# Altium project LPL_Control_board_Rev3.PrjPcb
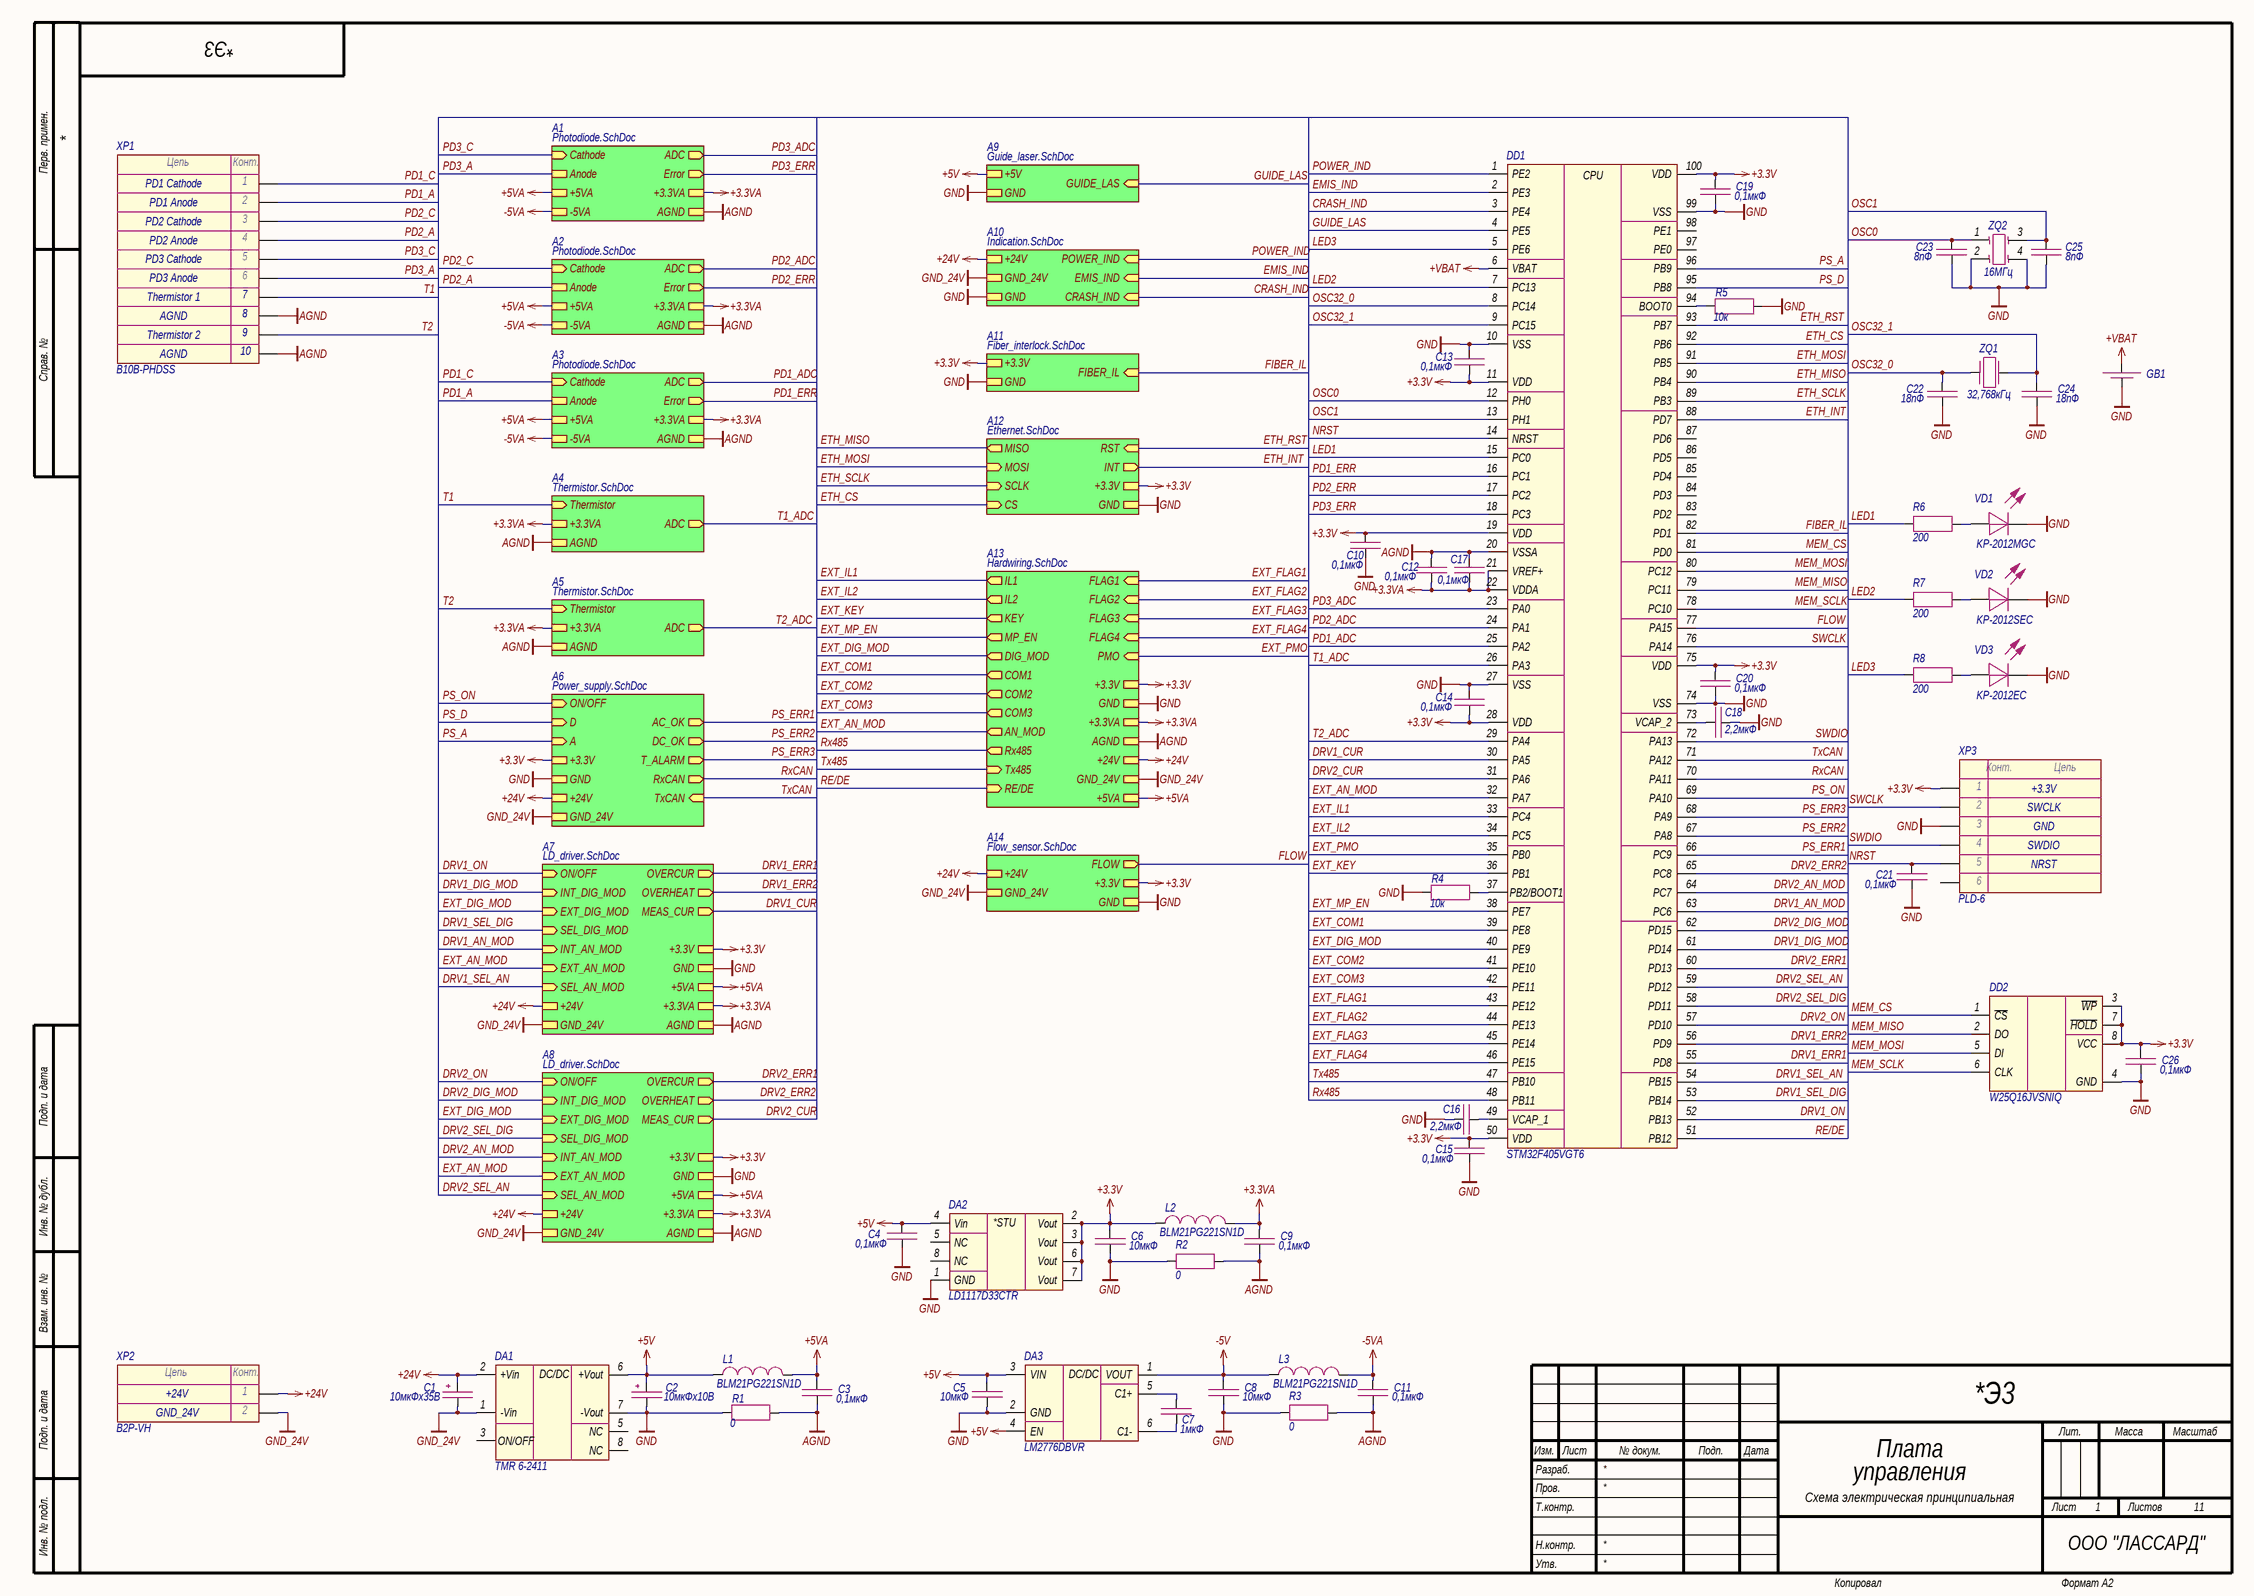
[diagram p0: Main.SchDoc]
6 sheets, 246 parts. Net scope: strictly hierarchical (ports join the sheet entries above them; power ports are local).
Board file: PCB1.PcbDoc
Sheets:
  Main.SchDoc
    A10 = Indication.SchDoc
    A13 = Hardwiring.SchDoc
    A1 = Photodiode.SchDoc
    A6 = Power_supply.SchDoc
    A9 = Guide_laser.SchDoc
    A2 = Photodiode.SchDoc
    A3 = Photodiode.SchDoc

## Sheet Main.SchDoc: Плата
size 594 x 420 mm; CompanyName: ООО "ЛАССАРД"; Address1: Address1; Address2: Address2; Address3: Address3; Address4: Address4; DocumentNumber: *Э3; SheetNumber: 1; SheetTotal: 11; Title2str: управления; DocumentType: Схема электрическая принципиальная

### Parts
C1  10мкФх35B  [CAP_C]
C2  10мкФх10B  [CAP_A]
C3  0,1мкФ  [CAP_0603]
C4  0,1мкФ  [CAP_0603]
C5  10мкФ  [CAP_0603]
C6  10мкФ  [CAP_0603]
C7  1мкФ  [CAP_0603]
C8  10мкФ  [CAP_0603]
C9  0,1мкФ  [CAP_0603]
C10  0,1мкФ  [CAP_0603]
C11  0,1мкФ  [CAP_0603]
C12  0,1мкФ  [CAP_0603]
C13  0,1мкФ  [CAP_0603]
C14  0,1мкФ  [CAP_0603]
C15  0,1мкФ  [CAP_0603]
C16  2,2мкФ  [CAP_0603]
C17  0,1мкФ  [CAP_0603]
C18  2,2мкФ  [CAP_0603]
C19  0,1мкФ  [CAP_0603]
C20  0,1мкФ  [CAP_0603]
C21  0,1мкФ  [CAP_0603]
C22  18пФ  [CAP_0603]
C23  8пФ  [CAP_0603]
C24  18пФ  [CAP_0603]
C25  8пФ  [CAP_0603]
C26  0,1мкФ  [CAP_0603]
DA1  TMR 6-2411  [TMR3 (SIP-8)]
DA2  LD1117D33CTR  [SOIC-8]
DA3  LM2776DBVR  [SOT-23-6]
DD1  STM32F405VGT6  [LQFP-100]
DD2  W25Q16JVSNIQ  [SOIC-8]
GB1  DS1092-12-N8S  [DS1092-12-N8S]  (value not drawn)
L1  BLM21PG221SN1D  [IND_0805]
L2  BLM21PG221SN1D  [IND_0805]
L3  BLM21PG221SN1D  [IND_0805]
R1  0  [RES_0805]
R2  0  [RES_0805]
R3  0  [RES_0805]
R4  10к  [RES_0603]
R5  10к  [RES_0603]
R6  200  [RES_0603]
R7  200  [RES_0603]
R8  200  [RES_0603]
VD1  KP-2012MGC  [LED_0805]
VD2  KP-2012SEC  [LED_0805]
VD3  KP-2012EC  [LED_0805]
XP1  B10B-PHDSS  [B10B-PHDSS]
XP2  B2P-VH  [B2P-VH]
XP3  PLD-6  [PLD-6]
ZQ1  32,768кГц  [NX3215SA]
ZQ2  16МГц  [NX2520SA]

### Sub-sheets
A1 = Photodiode.SchDoc: Cathode (in), ADC (out), Error (out), AGND, +5VA, +3.3VA, -5VA, Anode
A2 = Photodiode.SchDoc: Cathode (in), ADC (out), Error (out), AGND, +5VA, +3.3VA, -5VA, Anode
A3 = Photodiode.SchDoc: Cathode (in), ADC (out), Error (out), AGND, +5VA, +3.3VA, -5VA, Anode
A4 = Thermistor.SchDoc (file not in this document): Thermistor (in), +3.3VA, AGND, ADC (out)
A5 = Thermistor.SchDoc (file not in this document): Thermistor (in), +3.3VA, AGND, ADC (out)
A6 = Power_supply.SchDoc: ON/OFF (in), D (in), +3.3V, GND, +24V, GND_24V, AC_OK (out), DC_OK (out), RxCAN (out), TxCAN (in), T_ALARM (out), A (in)
A7 = LD_driver.SchDoc (file not in this document): +3.3V, GND, OVERCUR (out), OVERHEAT (out), +24V, GND_24V, ON/OFF (in), INT_DIG_MOD (in), INT_AN_MOD (in), EXT_DIG_MOD (in), SEL_DIG_MOD (in), EXT_AN_MOD (in), SEL_AN_MOD (in), MEAS_CUR (out), +5VA, +3.3VA, AGND
A8 = LD_driver.SchDoc (file not in this document): +3.3V, GND, OVERCUR (out), OVERHEAT (out), +24V, GND_24V, ON/OFF (in), INT_DIG_MOD (in), INT_AN_MOD (in), EXT_DIG_MOD (in), SEL_DIG_MOD (in), EXT_AN_MOD (in), SEL_AN_MOD (in), MEAS_CUR (out), +5VA, +3.3VA, AGND
A9 = Guide_laser.SchDoc: GUIDE_LAS (in), +5V, GND
A10 = Indication.SchDoc: GND_24V, +24V, CRASH_IND (in), POWER_IND (in), EMIS_IND (in), GND
A11 = Fiber_interlock.SchDoc (file not in this document): FIBER_IL (in), +3.3V, GND
A12 = Ethernet.SchDoc (file not in this document): MISO (out), RST (in), MOSI (in), INT (out), SCLK (in), CS (in), +3.3V, GND
A13 = Hardwiring.SchDoc: IL1 (out), FLAG1 (in), Rx485 (out), Tx485 (in), IL2 (out), KEY (out), MP_EN (out), AN_MOD (out), FLAG2 (in), FLAG3 (in), FLAG4 (in), PMO (in), COM1 (out), COM2 (out), COM3 (out), DIG_MOD (out), RE/DE (in), +3.3VA, AGND, +3.3V, GND, GND_24V, +24V, +5VA
A14 = Flow_sensor.SchDoc (file not in this document): FLOW (out), +24V, GND_24V, +3.3V, GND

### Nets
+3.3V: C6.1 C10.1 C13.2 C14.2 C15.2 C19.1 C20.1 C26.1 DA2.2(Vout) DA2.3(Vout) DA2.6(Vout) DA2.7(Vout) DD1.11(VDD) DD1.19(VDD) DD1.28(VDD) DD1.50(VDD) DD1.75(VDD) DD1.100(VDD) DD2.3(~{WP}) DD2.7(~{HOLD}) DD2.8(VCC) L2.1 XP3.1 ; sheet A13/+3.3V, sheet A12/+3.3V, sheet A6/+3.3V, sheet A7/+3.3V, sheet A11/+3.3V, sheet A14/+3.3V, sheet A8/+3.3V
+3.3VA: C9.1 C12.2 C17.2 DD1.21(VREF+) DD1.22(VDDA) L2.2 ; sheet A13/+3.3VA, sheet A1/+3.3VA, sheet A4/+3.3VA, sheet A7/+3.3VA, sheet A2/+3.3VA, sheet A5/+3.3VA, sheet A3/+3.3VA, sheet A8/+3.3VA
+5V: C2.1 C4.2 C5.1 DA1.6(+Vout) DA2.4(Vin) DA3.3(VIN) DA3.4(EN) L1.1 ; sheet A9/+5V
+5VA: C3.1 L1.2 ; sheet A13/+5VA, sheet A1/+5VA, sheet A7/+5VA, sheet A2/+5VA, sheet A3/+5VA, sheet A8/+5VA
+24V: C1.1 DA1.2(+Vin) XP2.1 ; sheet A10/+24V, sheet A13/+24V, sheet A6/+24V, sheet A7/+24V, sheet A14/+24V, sheet A8/+24V
+VBAT: DD1.6(VBAT) GB1.2
-5V: C8.1 DA3.1(VOUT) L3.1
-5VA: C11.1 L3.2 ; sheet A1/-5VA, sheet A2/-5VA, sheet A3/-5VA
AGND: C3.2 C9.2 C11.2 C12.1 C17.1 DD1.20(VSSA) R1.2 R2.2 R3.2 XP1.8 XP1.10 ; sheet A13/AGND, sheet A1/AGND, sheet A4/AGND, sheet A7/AGND, sheet A2/AGND, sheet A5/AGND, sheet A3/AGND, sheet A8/AGND
GND: C2.2 C4.1 C5.2 C6.2 C8.2 C10.2 C13.1 C14.1 C15.1 C16.2 C18.2 C19.2 C20.2 C21.2 C22.2 C23.2 C24.2 C25.2 C26.2 DA1.7(-Vout) DA2.1(GND) DA3.2(GND) DD1.10(VSS) DD1.27(VSS) DD1.74(VSS) DD1.99(VSS) DD2.4(GND) GB1.1 R1.1 R2.1 R3.1 R4.2 R5.2 VD1.2(C) VD2.2(C) VD3.2(C) XP3.3 ZQ2.2 ZQ2.4 ; sheet A10/GND, sheet A13/GND, sheet A12/GND, sheet A6/GND, sheet A7/GND, sheet A9/GND, sheet A11/GND, sheet A14/GND, sheet A8/GND
GND_24V: C1.2 DA1.1(-Vin) XP2.2 ; sheet A10/GND_24V, sheet A13/GND_24V, sheet A6/GND_24V, sheet A7/GND_24V, sheet A14/GND_24V, sheet A8/GND_24V
CRASH_IND: DD1.3(PE4) ; sheet A10/CRASH_IND
DRV1_AN_MOD: DD1.63(PC6) ; sheet A7/INT_AN_MOD
DRV1_CUR: DD1.30(PA5) ; sheet A7/MEAS_CUR
DRV1_DIG_MOD: DD1.61(PD14) ; sheet A7/INT_DIG_MOD
DRV1_ERR1: DD1.55(PD8) ; sheet A7/OVERCUR
DRV1_ERR2: DD1.56(PD9) ; sheet A7/OVERHEAT
DRV1_ON: DD1.52(PB13) ; sheet A7/ON/OFF
DRV1_SEL_AN: DD1.54(PB15) ; sheet A7/SEL_AN_MOD
DRV1_SEL_DIG: DD1.53(PB14) ; sheet A7/SEL_DIG_MOD
DRV2_AN_MOD: DD1.64(PC7) ; sheet A8/INT_AN_MOD
DRV2_CUR: DD1.31(PA6) ; sheet A8/MEAS_CUR
DRV2_DIG_MOD: DD1.62(PD15) ; sheet A8/INT_DIG_MOD
DRV2_ERR1: DD1.60(PD13) ; sheet A8/OVERCUR
DRV2_ERR2: DD1.65(PC8) ; sheet A8/OVERHEAT
DRV2_ON: DD1.57(PD10) ; sheet A8/ON/OFF
DRV2_SEL_AN: DD1.59(PD12) ; sheet A8/SEL_AN_MOD
DRV2_SEL_DIG: DD1.58(PD11) ; sheet A8/SEL_DIG_MOD
EMIS_IND: DD1.2(PE3) ; sheet A10/EMIS_IND
ETH_CS: DD1.92(PB6) ; sheet A12/CS
ETH_INT: DD1.88(PD7) ; sheet A12/INT
ETH_MISO: DD1.90(PB4) ; sheet A12/MISO
ETH_MOSI: DD1.91(PB5) ; sheet A12/MOSI
ETH_RST: DD1.93(PB7) ; sheet A12/RST
ETH_SCLK: DD1.89(PB3) ; sheet A12/SCLK
EXT_AN_MOD: DD1.32(PA7) ; sheet A13/AN_MOD, sheet A7/EXT_AN_MOD, sheet A8/EXT_AN_MOD
EXT_COM1: DD1.39(PE8) ; sheet A13/COM1
EXT_COM2: DD1.41(PE10) ; sheet A13/COM2
EXT_COM3: DD1.42(PE11) ; sheet A13/COM3
EXT_DIG_MOD: DD1.40(PE9) ; sheet A13/DIG_MOD, sheet A7/EXT_DIG_MOD, sheet A8/EXT_DIG_MOD
EXT_FLAG1: DD1.43(PE12) ; sheet A13/FLAG1
EXT_FLAG2: DD1.44(PE13) ; sheet A13/FLAG2
EXT_FLAG3: DD1.45(PE14) ; sheet A13/FLAG3
EXT_FLAG4: DD1.46(PE15) ; sheet A13/FLAG4
EXT_IL1: DD1.33(PC4) ; sheet A13/IL1
EXT_IL2: DD1.34(PC5) ; sheet A13/IL2
EXT_KEY: DD1.36(PB1) ; sheet A13/KEY
EXT_MP_EN: DD1.38(PE7) ; sheet A13/MP_EN
EXT_PMO: DD1.35(PB0) ; sheet A13/PMO
FIBER_IL: DD1.82(PD1) ; sheet A11/FIBER_IL
FLOW: DD1.77(PA15) ; sheet A14/FLOW
GUIDE_LAS: DD1.4(PE5) ; sheet A9/GUIDE_LAS
LED1: DD1.15(PC0) R6.1
LED2: DD1.7(PC13) R7.1
LED3: DD1.5(PE6) R8.1
MEM_CS: DD1.81(PD0) DD2.1(~{CS})
MEM_MISO: DD1.79(PC11) DD2.2(DO)
MEM_MOSI: DD1.80(PC12) DD2.5(DI)
MEM_SCLK: DD1.78(PC10) DD2.6(CLK)
NRST: C21.1 DD1.14(NRST) XP3.5
OSC0: C23.1 DD1.12(PH0) ZQ2.1
OSC1: C25.1 DD1.13(PH1) ZQ2.3
OSC32_0: C22.1 DD1.8(PC14) ZQ1.1
OSC32_1: C24.1 DD1.9(PC15) ZQ1.2
PD1_A: XP1.2 ; sheet A3/Anode
PD1_ADC: DD1.25(PA2) ; sheet A3/ADC
PD1_C: XP1.1 ; sheet A3/Cathode
PD1_ERR: DD1.16(PC1) ; sheet A3/Error
PD2_A: XP1.4 ; sheet A2/Anode
PD2_ADC: DD1.24(PA1) ; sheet A2/ADC
PD2_C: XP1.3 ; sheet A2/Cathode
PD2_ERR: DD1.17(PC2) ; sheet A2/Error
PD3_A: XP1.6 ; sheet A1/Anode
PD3_ADC: DD1.23(PA0) ; sheet A1/ADC
PD3_C: XP1.5 ; sheet A1/Cathode
PD3_ERR: DD1.18(PC3) ; sheet A1/Error
POWER_IND: DD1.1(PE2) ; sheet A10/POWER_IND
PS_A: DD1.96(PB9) ; sheet A6/A
PS_D: DD1.95(PB8) ; sheet A6/D
PS_ERR1: DD1.66(PC9) ; sheet A6/AC_OK
PS_ERR2: DD1.67(PA8) ; sheet A6/DC_OK
PS_ERR3: DD1.68(PA9) ; sheet A6/T_ALARM
PS_ON: DD1.69(PA10) ; sheet A6/ON/OFF
RE/DE: DD1.51(PB12) ; sheet A13/RE/DE
Rx485: DD1.48(PB11) ; sheet A13/Rx485
RxCAN: DD1.70(PA11) ; sheet A6/RxCAN
SWCLK: DD1.76(PA14) XP3.2
SWDIO: DD1.72(PA13) XP3.4
T1: XP1.7 ; sheet A4/Thermistor
T1_ADC: DD1.26(PA3) ; sheet A4/ADC
T2: XP1.9 ; sheet A5/Thermistor
T2_ADC: DD1.29(PA4) ; sheet A5/ADC
Tx485: DD1.47(PB10) ; sheet A13/Tx485
TxCAN: DD1.71(PA12) ; sheet A6/TxCAN
NetC7_1: C7.1 DA3.5(C1+)
NetC7_2: C7.2 DA3.6(C1-)
NetC16_1: C16.1 DD1.49(VCAP_1)
NetC18_1: C18.1 DD1.73(VCAP_2)
NetDD1_37: DD1.37(PB2/BOOT1) R4.1
NetDD1_94: DD1.94(BOOT0) R5.1
NetR6_2: R6.2 VD1.1(A)
NetR7_2: R7.2 VD2.1(A)
NetR8_2: R8.2 VD3.1(A)

Not connected (* = marked no-connect by the designer): DA1 3(ON/OFF) 5(NC) 8(NC); DA2 5(NC) 8(NC); DD1 83(PD2) 84(PD3) 85(PD4) 86(PD5) 87(PD6) 97(PE0) 98(PE1); XP3 6

### Notes on the sheet
- PD1 Cathode
- PD1 Anode
- PD2 Cathode
- PD2 Anode
- PD3 Cathode
- Thermistor 1
- AGND
- PD3 Anode
- Thermistor 2
- +3.3V
- SWCLK
- GND
- SWDIO
- NRST
- +24V
- GND_24V
- Перв. примен.
- Справ. №
- Подп. и дата
- Инв. № дубл.
- Взам. инв. №
- Разраб.
- Изм.
- Лист
- № докум.
- Подп.
- Дата
- Лит.
- Масса
- Масштаб
- Пров.
- Т.контр.
- Листов
- Инв. № подл.
- Утв.
- Н.контр.
- Копировал
- Формат А2
- (in symbol Connector-2) Цепь; Конт.
- (in symbol Connector-10) Цепь; Конт.
- (in symbol LD1117D33) *STU
- (in symbol LM2776DBVR) DC/DC
- (in symbol STM32F405VG) CPU
- (in symbol TMR3) DC/DC

### Library data of the parts
C1 = Capacitor_Polar: Model: TECAP, 10 мкФ, 35 В, тип C, 10%; Value: 10мкФх35B; Document: *; Manufacturer: *
C2 = Capacitor_Polar: Model: TECAP, 10 мкФ, 10 В, тип A, 10%; Value: 10мкФх10B; Document: *; Manufacturer: *
C3 C4 C9-C15 C17 C19-C21 C26 = Capacitor: Manufacturer: Murata; Model: GRM188R71H104KA93D; Value: 0,1мкФ; Document: *
C5 C6 C8 = Capacitor: Manufacturer: Murata; Model: GRM188R61E106KA73D; Value: 10мкФ; Document: *
C7 = Capacitor: Manufacturer: Murata; Model: GRM188R61H105KAALD; Value: 1мкФ; Document: *
C16 C18 = Capacitor: Manufacturer: Murata; Model: GRM188R61H225KE11D; Value: 2,2мкФ; Document: *
C22 C24 = Capacitor: Manufacturer: Murata; Model: GRM1885C1H180FA01D; Value: 18пФ; Document: *
C23 C25 = Capacitor: Manufacturer: Yageo; Model: CC0603CRNPO9BN8R0; Value: 8пФ; Document: *
DA1 = TMR3: Manufacturer: Traco Power; Model: TMR 6-2411; Document: *
DA2 = LD1117D33: Manufacturer: STMicroelectronics; Model: LD1117D33CTR; Document: *
DA3 = LM2776DBVR: Manufacturer: Texas Instruments; Model: LM2776DBVR; Document: *
DD1 = STM32F405VG: Manufacturer: STMicroelectronics; Model: STM32F405VGT6; Document: *
DD2 = W25Q: Manufacturer: Winbond; Model: W25Q16JVSNIQ; Document: *
GB1 = Accumulator: Manufacturer: Connfly; Model: DS1092-12-N8S; Document: *
L1-L3 = Inductor: Manufacturer: Murata; Value: *; Model: BLM21PG221SN1D; Document: *
R1-R3 = Resistor: Manufacturer: Yageo; Model: RC0805FR-070RL; Value: 0; Document: *
R4 R5 = Resistor: Manufacturer: Yageo; Model: RC0603FR-0710KL; Value: 10к; Document: *
R6-R8 = Resistor: Manufacturer: Yageo; Model: RC0603FR-07200RL; Value: 200; Document: *
VD1-VD3 = LED: Manufacturer: Kingbright; Document: *
  VD1: Model: KP-2012MGC
  VD2: Model: KP-2012SEC
  VD3: Model: KP-2012EC
XP1 = Connector-10: Manufacturer: JST; Model: B10B-PHDSS; Document: *
XP2 = Connector-2: Manufacturer: JST; Model: B2P-VH; Document: *
XP3 = Connector-6: Manufacturer: Connfly; Model: PLD-6; Document: *
ZQ1 = Quartz_Resonator: Manufacturer: NDK; Model: NX3215SA- 32.768K-STD-MUA-8; Value: 32,768кГц; Document: *
ZQ2 = Quartz_Resonator_4-pin: Manufacturer: NDK; Model: NX2520SA-16MHZ-STD-CSW-5; Value: 16МГц; Document: *

## Sheet Indication.SchDoc
size 420 x 297 mm; Address1: Address1; Address2: Address2; Address3: Address3; Address4: Address4; DocumentNumber: *Э3; SheetNumber: 7; SheetTotal: 11; DocumentType: Схема электрическая *
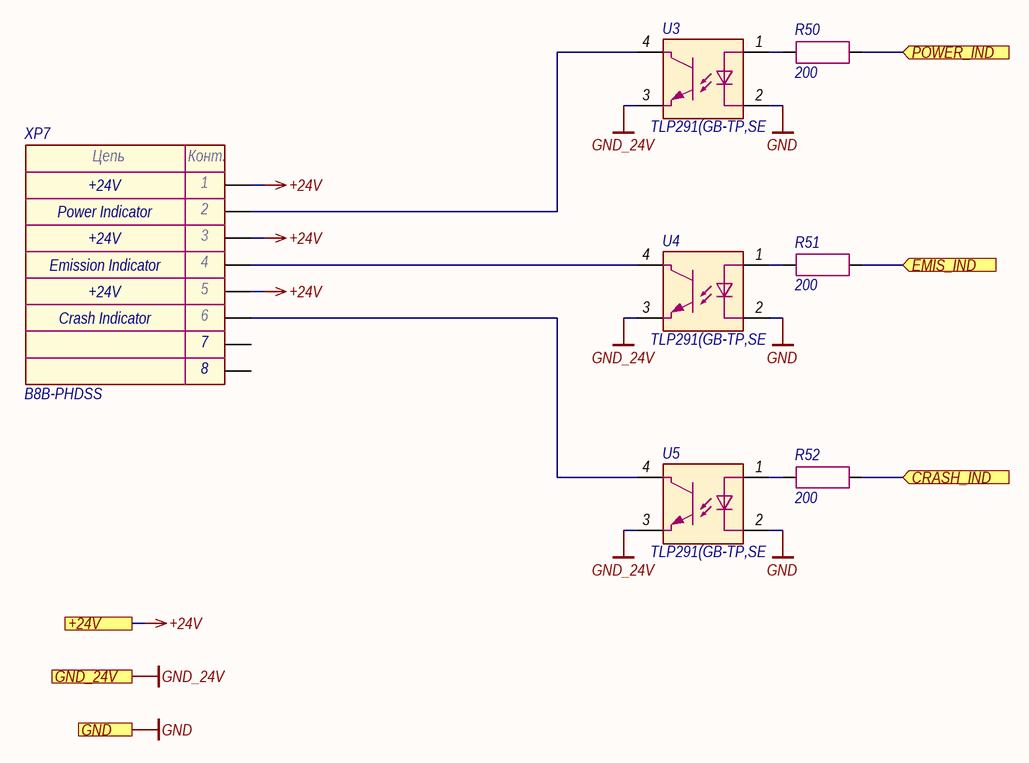
[diagram p1: Indication.SchDoc]

### Parts
R50  200  [RES_0603]
R51  200  [RES_0603]
R52  200  [RES_0603]
U3  TLP291(GB-TP,SE  [11-3C1]
U4  TLP291(GB-TP,SE  [11-3C1]
U5  TLP291(GB-TP,SE  [11-3C1]
XP7  B8B-PHDSS  [B8B-PHDSS]

### Ports
+24V (see Main[2A], Flow_sensor[2C], Hardwiring[3C], LD_driver[1D], Power_supply[1D]), CRASH_IND (in, see Main[3A]), EMIS_IND (in, see Main[3A]), GND (see Main[2A], Ethernet[3D], Fiber_interlock[2C], Flow_sensor[2C], Guide_laser[1C], Hardwiring[3D], LD_driver[1D], Power_supply[1D]), GND_24V (see Main[2A], Flow_sensor[2C], Hardwiring[3C], LD_driver[1D], Power_supply[1D]), POWER_IND (in, see Main[3A])

### Nets
+24V: XP7.1 XP7.3 XP7.5 ; port +24V
GND: U3.2 U4.2 U5.2 ; port GND
GND_24V: U3.3 U4.3 U5.3 ; port GND_24V
CRASH_IND: R52.2 ; port CRASH_IND
EMIS_IND: R51.2 ; port EMIS_IND
POWER_IND: R50.2 ; port POWER_IND
NetR50_1: R50.1 U3.1
NetR51_1: R51.1 U4.1
NetR52_1: R52.1 U5.1
NetU3_4: U3.4 XP7.2
NetU4_4: U4.4 XP7.4
NetU5_4: U5.4 XP7.6

Not connected (* = marked no-connect by the designer): XP7 7 8

### Notes on the sheet
- Power Indicator
- +24V
- (near XP7) Emission Indicator
- Crash Indicator
- Подп. и дата
- Инв. № дубл.
- Взам. инв. №
- Инв. № подл.
- Изм.
- Лист
- № докум.
- Подп.
- Дата
- Копировал
- Формат А3
- (in symbol Connector-8) Цепь; Конт.

### Library data of the parts
R50-R52 = Resistor: as R6 on sheet Main; Value: 200; Document: *
U3-U5 = TLP291: Manufacturer: Toshiba; Model: TLP291(GB-TP,SE; Document: *
XP7 = Connector-8: Manufacturer: JST; Model: B8B-PHDSS; Document: *

## Sheet Hardwiring.SchDoc
size 594 x 420 mm; Address1: Address1; Address2: Address2; Address3: Address3; Address4: Address4; DocumentNumber: *Э3; SheetNumber: 10; SheetTotal: 11; DocumentType: Схема электрическая *
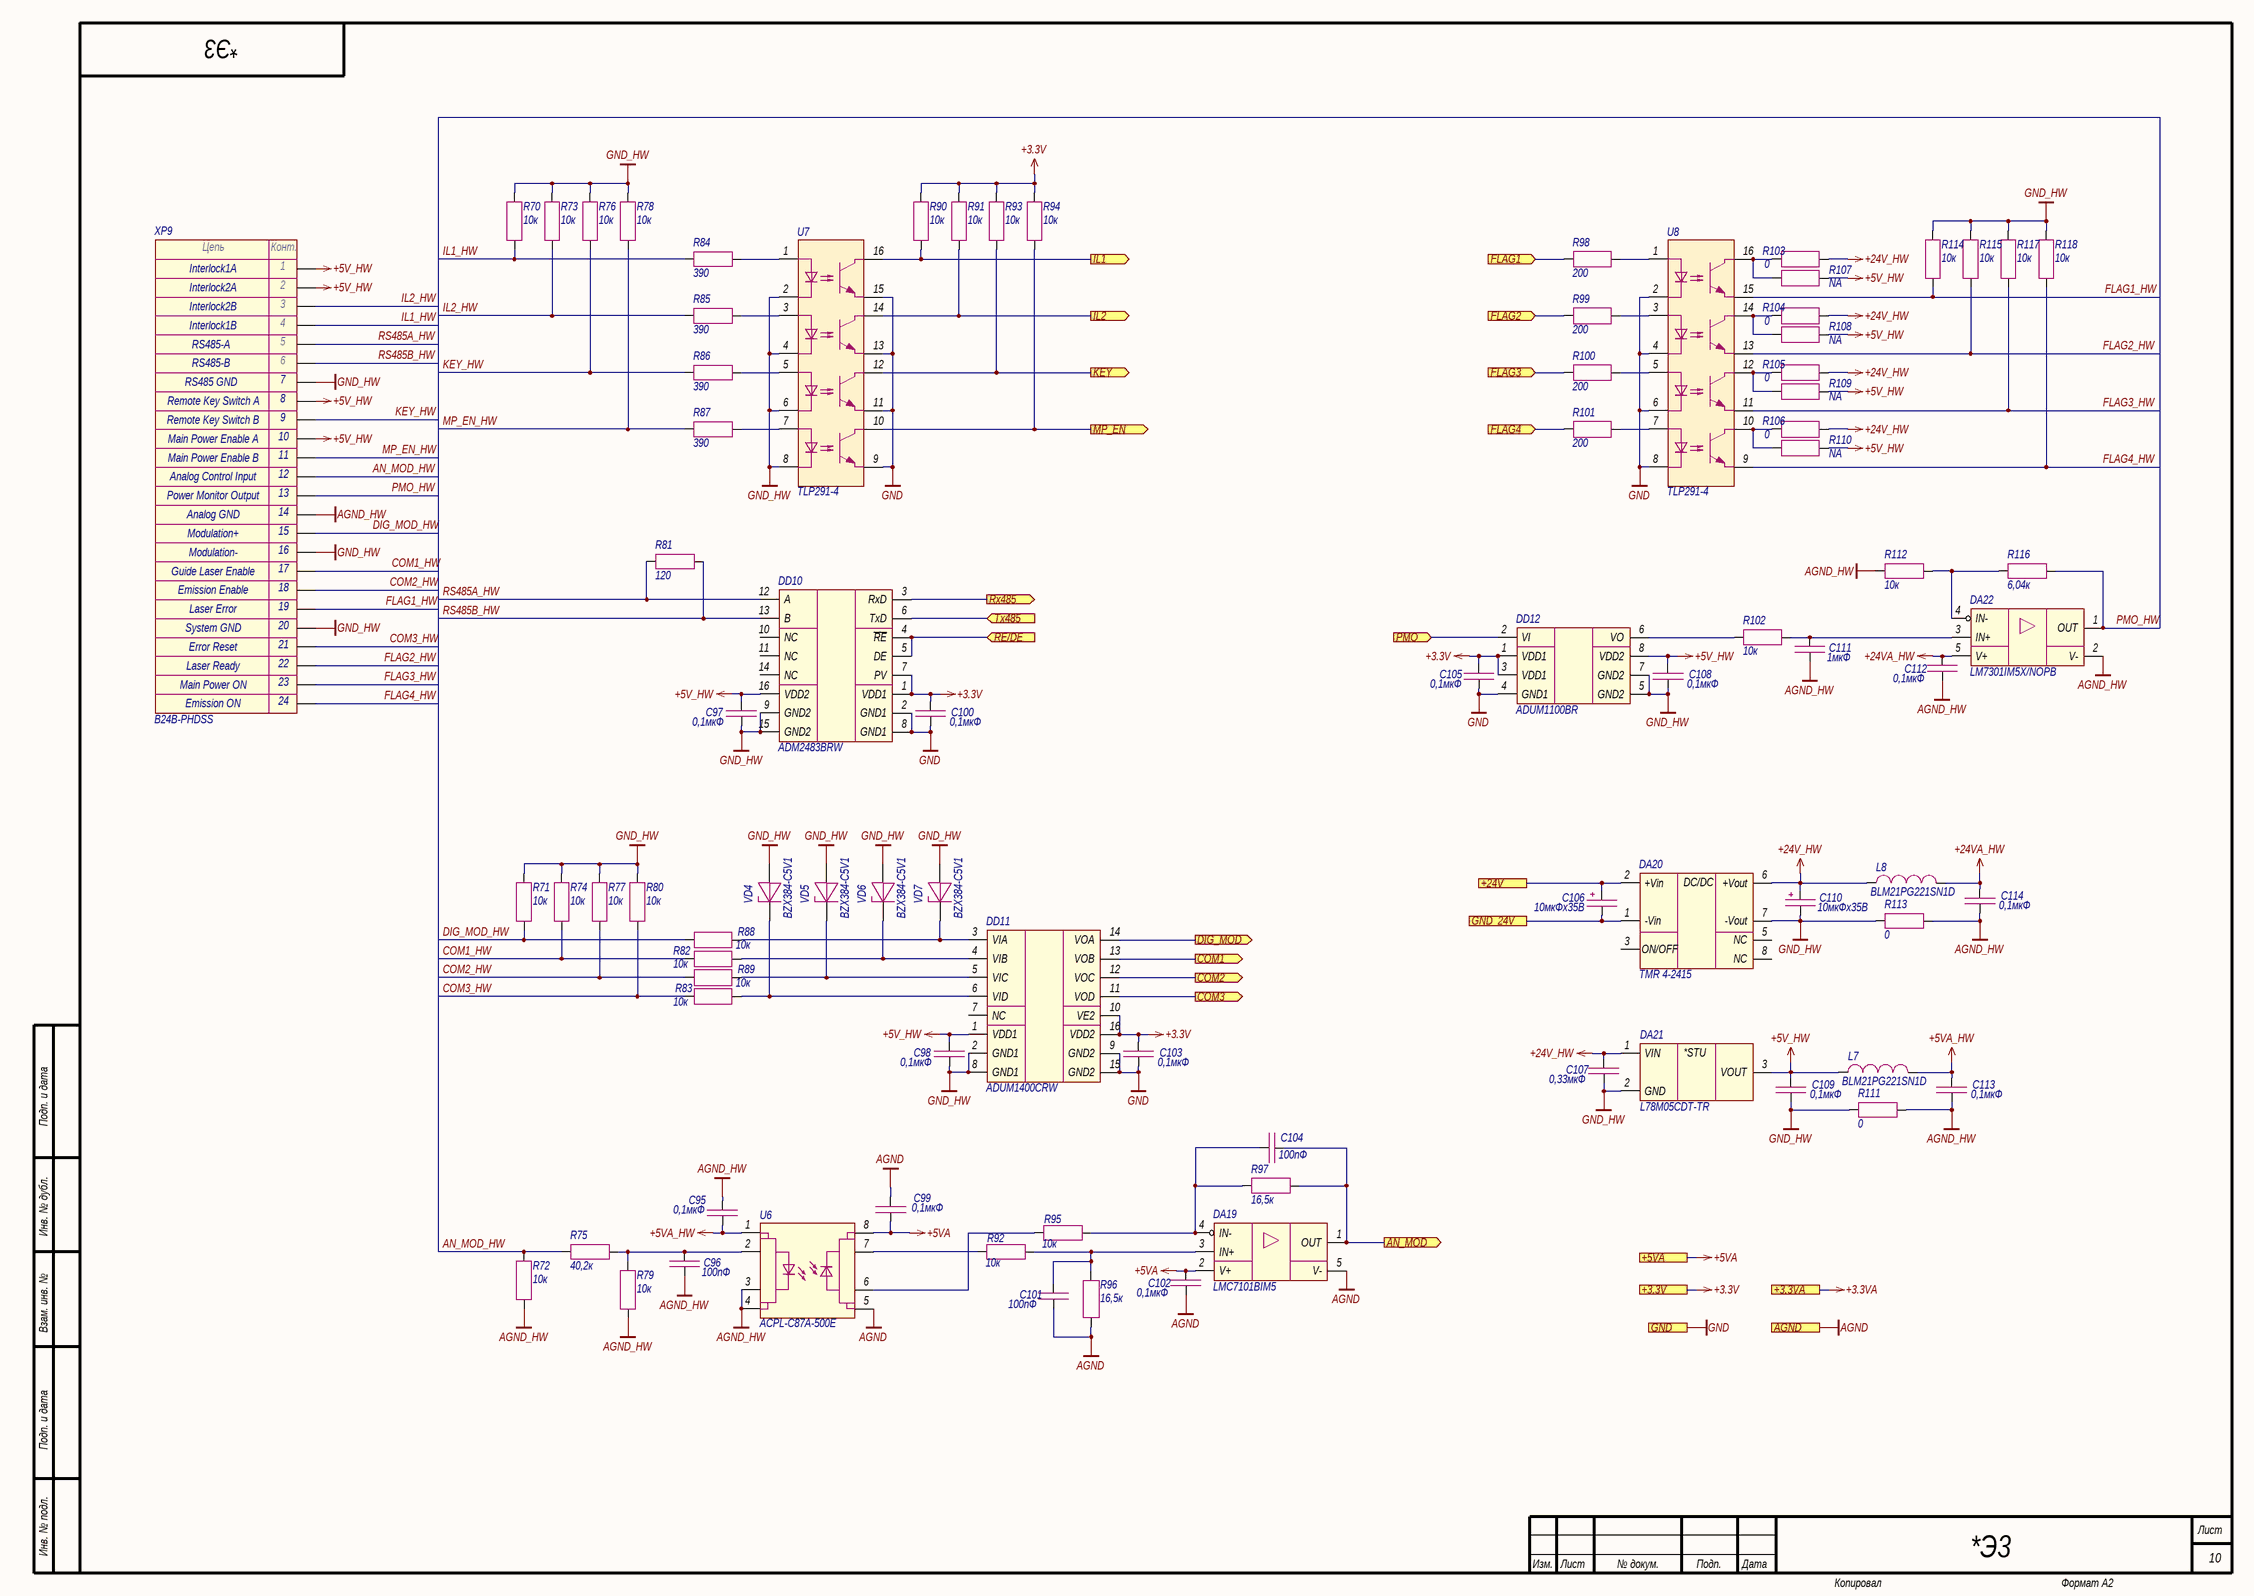
[diagram p2: Hardwiring.SchDoc]

### Parts
C95  0,1мкФ  [CAP_0603]
C96  100пФ  [CAP_0603]
C97  0,1мкФ  [CAP_0603]
C98  0,1мкФ  [CAP_0603]
C99  0,1мкФ  [CAP_0603]
C100  0,1мкФ  [CAP_0603]
C101  100пФ  [CAP_0603]
C102  0,1мкФ  [CAP_0603]
C103  0,1мкФ  [CAP_0603]
C104  100пФ  [CAP_0603]
C105  0,1мкФ  [CAP_0603]
C106  10мкФх35B  [CAP_C]
C107  0,33мкФ  [CAP_0805]
C108  0,1мкФ  [CAP_0603]
C109  0,1мкФ  [CAP_0603]
C110  10мкФх35B  [CAP_C]
C111  1мкФ  [CAP_0603]
C112  0,1мкФ  [CAP_0603]
C113  0,1мкФ  [CAP_0603]
C114  0,1мкФ  [CAP_0603]
DA19  LMC7101BIM5  [SOT-23-5]
DA20  TMR 4-2415  [TMR4 (SIP-8)]
DA21  L78M05CDT-TR  [TO-252]
DA22  LM7301IM5X/NOPB  [SOT-23-5]
DD10  ADM2483BRW  [SOIC-16W]
DD11  ADUM1400CRW  [SOIC-16W]
DD12  ADUM1100BR  [SOIC-8]
L7  BLM21PG221SN1D  [IND_0805]
L8  BLM21PG221SN1D  [IND_0805]
R70  10к  [RES_0603]
R71  10к  [RES_0603]
R72  10к  [RES_0603]
R73  10к  [RES_0603]
R74  10к  [RES_0603]
R75  40,2к  [RES_0603]
R76  10к  [RES_0603]
R77  10к  [RES_0603]
R78  10к  [RES_0603]
R79  10к  [RES_0603]
R80  10к  [RES_0603]
R81  120  [RES_0805]
R82  10к  [RES_0603]
R83  10к  [RES_0603]
R84  390  [RES_0603]
R85  390  [RES_0603]
R86  390  [RES_0603]
R87  390  [RES_0603]
R88  10к  [RES_0603]
R89  10к  [RES_0603]
R90  10к  [RES_0603]
R91  10к  [RES_0603]
R92  10к  [RES_0603]
R93  10к  [RES_0603]
R94  10к  [RES_0603]
R95  10к  [RES_0603]
R96  16,5к  [RES_0603]
R97  16,5к  [RES_0603]
R98  200  [RES_0603]
R99  200  [RES_0603]
R100  200  [RES_0603]
R101  200  [RES_0603]
R102  10к  [RES_0603]
R103  0  [RES_0603]
R104  0  [RES_0603]
R105  0  [RES_0603]
R106  0  [RES_0603]
R107  NA  [RES_0603]
R108  NA  [RES_0603]
R109  NA  [RES_0603]
R110  NA  [RES_0603]
R111  0  [RES_0805]
R112  10к  [RES_0603]
R113  0  [RES_0805]
R114  10к  [RES_0603]
R115  10к  [RES_0603]
R116  6,04к  [RES_0603]
R117  10к  [RES_0603]
R118  10к  [RES_0603]
U6  ACPL-C87A-500E  [SSO-8]
U7  TLP291-4  [SOP-16]
U8  TLP291-4  [SOP-16]
VD4  BZX384-C5V1  [SOD-323]
VD5  BZX384-C5V1  [SOD-323]
VD6  BZX384-C5V1  [SOD-323]
VD7  BZX384-C5V1  [SOD-323]
XP9  B24B-PHDSS  [B24B-PHDSS]

### Ports
+3.3V (see Main[3B], Ethernet[3D], Fiber_interlock[2C], Flow_sensor[2C], LD_driver[1D], Power_supply[1D]), +3.3VA (see Main[3B], LD_driver[1D], Photodiode[1C], Thermistor[2C]), +5VA (see Main[3B], LD_driver[1D], Photodiode[1C]), +24V (see Main[3B], Flow_sensor[2C], Indication[1C], LD_driver[1D], Power_supply[1D]), AGND (see Main[3B], LD_driver[1D], Photodiode[1D], Thermistor[2C]), AN_MOD (out, see Main[2B]), COM1 (out, see Main[2B]), COM2 (out, see Main[2B]), COM3 (out, see Main[2B]), DIG_MOD (out, see Main[2B]), FLAG1 (in, see Main[3B]), FLAG2 (in, see Main[3B]), FLAG3 (in, see Main[3B]), FLAG4 (in, see Main[3B]), GND (see Main[3B], Ethernet[3D], Fiber_interlock[2C], Flow_sensor[2C], Guide_laser[1C], Indication[1C], LD_driver[1D], Power_supply[1D]), GND_24V (see Main[3B], Flow_sensor[2C], Indication[1C], LD_driver[1D], Power_supply[1D]), IL1 (out, see Main[2B]), IL2 (out, see Main[2B]), KEY (out, see Main[2B]), MP_EN (out, see Main[2B]), PMO (in, see Main[3B]), RE/DE (in, see Main[2B]), Rx485 (out, see Main[2B]), Tx485 (in, see Main[2B])

### Nets
+3.3V: C100.1 C103.1 C105.1 DD10.1(VDD1) DD10.7(PV) DD11.10(VE2) DD11.16(VDD2) DD12.1(VDD1) DD12.3(VDD1) R90.1 R91.1 R93.1 R94.1 ; port +3.3V
+5V_HW: C97.1 C98.1 C108.1 C109.1 DA21.3(VOUT) DD10.16(VDD2) DD11.1(VDD1) DD12.8(VDD2) L7.1 R107.2 R108.2 R109.2 R110.2 XP9.1 XP9.2 XP9.8 XP9.10
+5VA: C99.1 C102.1 DA19.2(V+) U6.8(VDD2) ; port +5VA
+5VA_HW: C95.1 C113.1 L7.2 U6.1(VDD1)
+24V: C106.1 DA20.2(+Vin) ; port +24V
+24V_HW: C107.2 C110.1 DA20.6(+Vout) DA21.1(VIN) L8.1 R103.2 R104.2 R105.2 R106.2
+24VA_HW: C112.1 C114.1 DA22.5(V+) L8.2
AGND: C99.2 C101.2 C102.2 DA19.5(V-) R96.2 U6.5(GND2) ; port AGND
AGND_HW: C95.2 C96.1 C111.2 C112.2 C113.2 C114.2 DA22.2(V-) R72.2 R79.2 R111.2 R112.1 R113.2 U6.3(SHDN) U6.4(GND1) XP9.14
GND: C100.2 C103.2 C105.2 DD10.2(GND1) DD10.8(GND1) DD11.9(GND2) DD11.15(GND2) DD12.4(GND1) U7.9 U7.11 U7.13 U7.15 U8.2 U8.4 U8.6 U8.8 ; port GND
GND_24V: C106.2 DA20.1(-Vin) ; port GND_24V
GND_HW: C97.2 C98.2 C107.1 C108.2 C109.2 C110.2 DA20.7(-Vout) DA21.2(GND) DD10.9(GND2) DD10.15(GND2) DD11.2(GND1) DD11.8(GND1) DD12.5(GND2) DD12.7(GND2) R70.1 R71.1 R73.1 R74.1 R76.1 R77.1 R78.1 R80.1 R111.1 R113.1 R114.1 R115.1 R117.1 R118.1 U7.2 U7.4 U7.6 U7.8 VD4.2(A) VD5.2(A) VD6.2(A) VD7.2(A) XP9.7 XP9.16 XP9.20
AN_MOD_HW: R72.1 R75.2 XP9.12
COM1_HW: R74.2 R82.1 XP9.17
COM2_HW: R77.2 R89.1 XP9.18
COM3_HW: R80.2 R83.1 XP9.21
DIG_MOD_HW: R71.2 R88.1 XP9.15
EXT_AN_MOD: C104.2 DA19.1(OUT) R97.1 ; port AN_MOD
EXT_COM1: DD11.13(VOB) ; port COM1
EXT_COM2: DD11.12(VOC) ; port COM2
EXT_COM3: DD11.11(VOD) ; port COM3
EXT_DIG_MOD: DD11.14(VOA) ; port DIG_MOD
EXT_FLAG1: R98.2 ; port FLAG1
EXT_FLAG2: R99.2 ; port FLAG2
EXT_FLAG3: R100.2 ; port FLAG3
EXT_FLAG4: R101.2 ; port FLAG4
EXT_IL1: R90.2 U7.16 ; port IL1
EXT_IL2: R91.2 U7.14 ; port IL2
EXT_KEY: R93.2 U7.12 ; port KEY
EXT_MP_EN: R94.2 U7.10 ; port MP_EN
EXT_PMO: DD12.2(VI) ; port PMO
FLAG1_HW: R114.2 U8.15 XP9.19
FLAG2_HW: R115.2 U8.13 XP9.22
FLAG3_HW: R117.2 U8.11 XP9.23
FLAG4_HW: R118.2 U8.9 XP9.24
IL1_HW: R70.2 R84.1 XP9.4
IL2_HW: R73.2 R85.1 XP9.3
KEY_HW: R76.2 R86.1 XP9.9
MP_EN_HW: R78.2 R87.1 XP9.11
PMO_HW: DA22.1(OUT) R116.2 XP9.13
RE/DE: DD10.4(~{RE}) DD10.5(DE) ; port RE/DE
RS485A_HW: DD10.12(A) R81.1 XP9.5
RS485B_HW: DD10.13(B) R81.2 XP9.6
Rx485: DD10.3(RxD) ; port Rx485
Tx485: DD10.6(TxD) ; port Tx485
NetC96_2: C96.2 R75.1 R79.1 U6.2(VIN)
NetC101_1: C101.1 DA19.3(IN+) R92.2 R96.1
NetC104_1: C104.1 DA19.4(IN-) R95.2 R97.2
NetC111_1: C111.1 DA22.3(IN+) R102.2
NetDA22_4: DA22.4(IN-) R112.2 R116.1
NetDD11_3: DD11.3(VIA) R88.2 VD7.1(K)
NetDD11_4: DD11.4(VIB) R82.2 VD6.1(K)
NetDD11_5: DD11.5(VIC) R89.2 VD5.1(K)
NetDD11_6: DD11.6(VID) R83.2 VD4.1(K)
NetDD12_6: DD12.6(VO) R102.1
NetR84_2: R84.2 U7.1
NetR85_2: R85.2 U7.3
NetR86_2: R86.2 U7.5
NetR87_2: R87.2 U7.7
NetR92_1: R92.1 U6.7(VOUT+)
NetR95_1: R95.1 U6.6(VOUT-)
NetR98_1: R98.1 U8.1
NetR99_1: R99.1 U8.3
NetR100_1: R100.1 U8.5
NetR101_1: R101.1 U8.7
NetR103_1: R103.1 R107.1 U8.16
NetR104_1: R104.1 R108.1 U8.14
NetR105_1: R105.1 R109.1 U8.12
NetR106_1: R106.1 R110.1 U8.10

Not connected (* = marked no-connect by the designer): DA20 3(ON/OFF) 5(NC) 8(NC); DD10 10(NC) 11(NC) 14(NC); DD11 7(NC)

### Notes on the sheet
- Interlock1A
- Interlock2A
- Interlock2B
- RS485-A
- RS485-B
- Interlock1B
- RS485 GND
- (near XP9) Remote Key Switch A
- (near XP9) Remote Key Switch B
- (near XP9) Main Power Enable A
- (near XP9) Main Power Enable B
- (near XP9) Analog Control Input
- (near XP9) Power Monitor Output
- Analog GND
- Modulation+
- Modulation-
- (near XP9) Guide Laser Enable
- (near XP9) Emission Enable
- System GND
- Error Reset
- Laser Error
- Main Power ON
- Emission ON
- Laser Ready
- Подп. и дата
- Инв. № дубл.
- Взам. инв. №
- Инв. № подл.
- Изм.
- Лист
- № докум.
- Подп.
- Дата
- Копировал
- Формат А2
- (in symbol Connector-24) Цепь; Конт.
- (in symbol L78M) *STU
- (in symbol TMR4) DC/DC

### Library data of the parts
C95 C97-C100 C102 C103 C105 C108 C109 C112-C114 = Capacitor: as C3 on sheet Main; Value: 0,1мкФ; Document: *
C96 C101 C104 = Capacitor: Manufacturer: Murata; Model: GRM1885C1H101JA01D; Value: 100пФ; Document: *
C106 C110 = Capacitor_Polar: Model: TECAP, 10 мкФ, 35 В, тип C, 10%; Value: 10мкФх35B; Document: *; Manufacturer: *
C107 = Capacitor: Manufacturer: Murata; Model: GRM219R71H334KA88D; Value: 0,33мкФ; Document: *
C111 = Capacitor: as C7 on sheet Main; Value: 1мкФ; Document: *
DA19 = LMC7101: Manufacturer: Texas Instruments; Model: LMC7101BIM5; Document: *
DA20 = TMR4: Manufacturer: Traco Power; Model: TMR 4-2415; Document: *
DA21 = L78M: Manufacturer: STMicroelectronics; Model: L78M05CDT-TR; Document: *
DA22 = LM7301IM5: Manufacturer: Texas Instruments; Model: LM7301IM5X/NOPB; Document: *
DD10 = ADM2483BRW: Manufacturer: Analog Devices; Model: ADM2483BRW; Document: *
DD11 = ADUM1400: Manufacturer: Analog Devices; Model: ADUM1400CRW; Document: *
DD12 = ADUM1100: Manufacturer: Analog Devices; Model: ADUM1100BR; Document: *
L7 L8 = Inductor: Manufacturer: Murata; Value: *; Model: BLM21PG221SN1D; Document: *
R70-R74 R76-R80 R82 R83 R88-R95 R102 R112 R114 R115 R117 R118 = Resistor: as R4 on sheet Main; Value: 10к; Document: *
R75 = Resistor: Manufacturer: Yageo; Model: RC0603FR-0740K2L; Value: 40,2к; Document: *
R81 = Resistor: Manufacturer: Yageo; Model: RC0805FR-07120RL; Value: 120; Document: *
R84-R87 = Resistor: Manufacturer: Yageo; Model: RC0603FR-07390RL; Value: 390; Document: *
R96 R97 = Resistor: Manufacturer: Yageo; Model: RC0603FR-0716K5L; Value: 16,5к; Document: *
R98-R101 = Resistor: as R6 on sheet Main; Value: 200; Document: *
R103-R106 = Resistor: Manufacturer: Yageo; Model: RC0603FR-070RL; Value: 0; Document: *
R107-R110 = Resistor: Value: NA; Model: *; Document: *; Manufacturer: *
R111 R113 = Resistor: as R1 on sheet Main; Value: 0; Document: *
R116 = Resistor: Manufacturer: Yageo; Model: RC0603FR-076K04L; Value: 6,04к; Document: *
U6 = ACPL-C87: Manufacturer: Broadcom; Model: ACPL-C87A-500E
U7 U8 = TLP281-4: Manufacturer: Toshiba; Model: TLP291-4; Document: *
VD4-VD7 = Diode_Zener: Manufacturer: Nexperia; Model: BZX384-C5V1; Document: *
XP9 = Connector-24: Manufacturer: JST; Model: B24B-PHDSS; Document: *

## Sheet Photodiode.SchDoc
size 420 x 297 mm; Address1: Address1; Address2: Address2; Address3: Address3; Address4: Address4; DocumentNumber: *Э3; SheetNumber: 2; SheetTotal: 11; DocumentType: Схема электрическая *
Used 3 times, as channels A1, A2, A3. Parts and nets are listed once, with the designators drawn on the sheet.
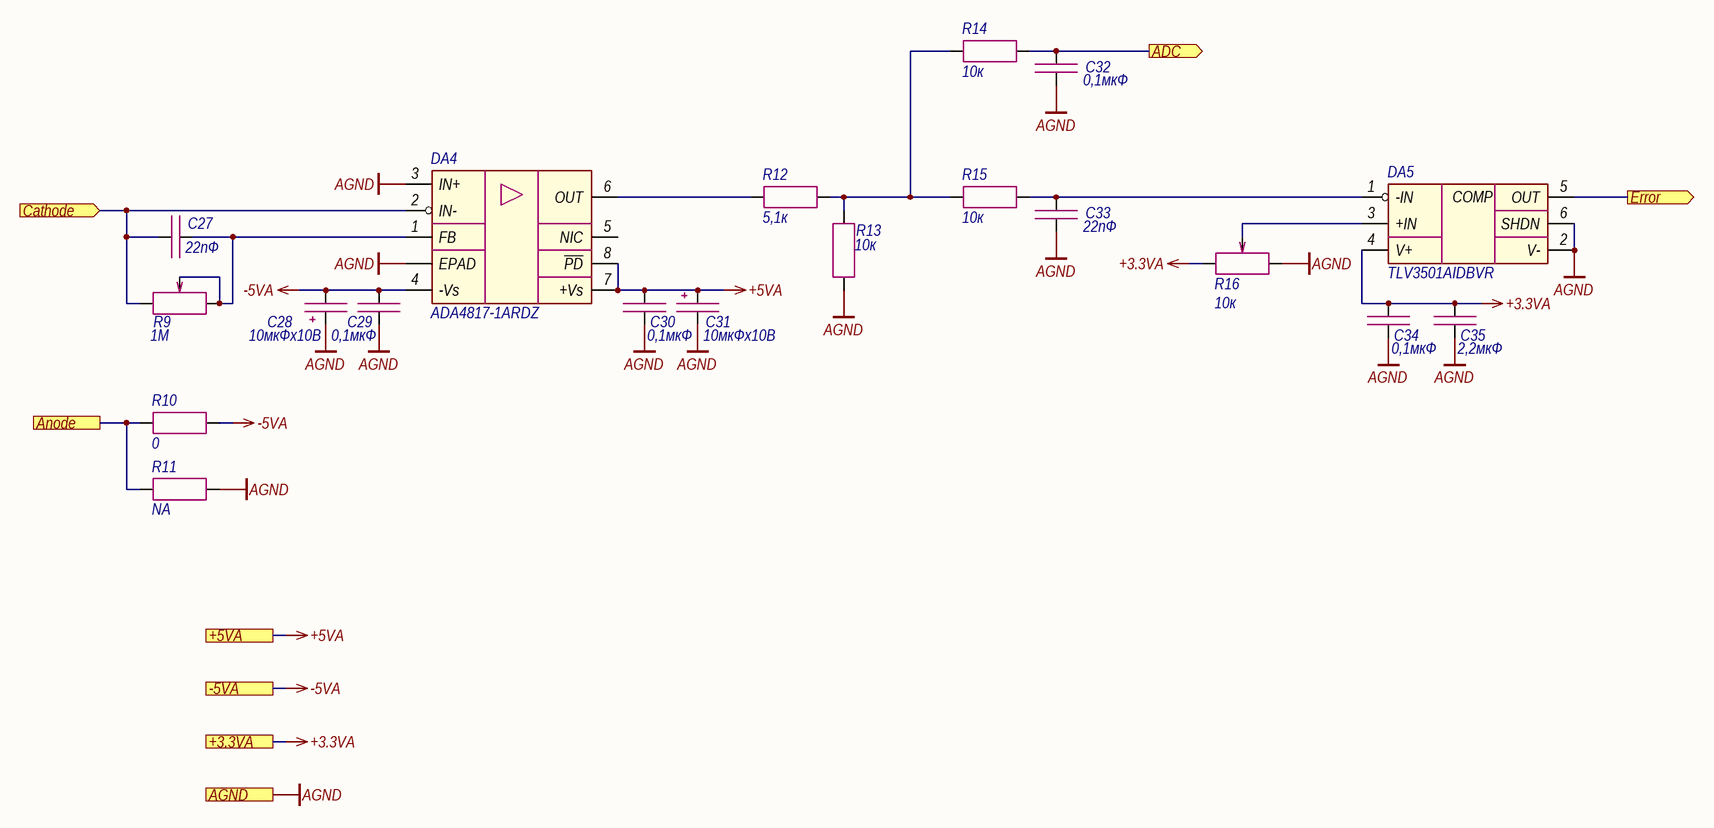
[diagram p3: Photodiode.SchDoc]

### Parts
C27  22пФ  [CAP_0603]
C28  10мкФх10B  [CAP_A]
C29  0,1мкФ  [CAP_0603]
C30  0,1мкФ  [CAP_0603]
C31  10мкФх10B  [CAP_A]
C32  0,1мкФ  [CAP_0603]
C33  22пФ  [CAP_0603]
C34  0,1мкФ  [CAP_0603]
C35  2,2мкФ  [CAP_0603]
DA4  ADA4817-1ARDZ  [SOIC-8 EPAD]
DA5  TLV3501AIDBVR  [SOT-23-6]
R9  1М  [3224W]
R10  0  [RES_0603]
R11  NA  [RES_0603]
R12  5,1к  [RES_0603]
R13  10к  [RES_0603]
R14  10к  [RES_0603]
R15  10к  [RES_0603]
R16  10к  [3224W]

### Ports
+3.3VA (see Main[2A], Hardwiring[4D], LD_driver[1D], Thermistor[2C]), +5VA (see Main[1A], Hardwiring[3D], LD_driver[1D]), -5VA (see Main[1A]), ADC (out, see Main[2A]), AGND (see Main[2A], Hardwiring[4D], LD_driver[1D], Thermistor[2C]), Anode (see Main[1A]), Cathode (in, see Main[1A]), Error (out, see Main[2A])

### Nets
+3.3VA: C34.1 C35.1 DA5.4(V+) R16.3 ; port +3.3VA
+5VA: C30.1 C31.1 DA4.7(+Vs) DA4.8(~{PD}) ; port +5VA
-5VA: C28.2 C29.1 DA4.4(-Vs) R10.1 ; port -5VA
AGND: C28.1 C29.2 C30.2 C31.2 C32.2 C33.2 C34.2 C35.2 DA4.3(IN+) DA4.EPAD DA5.2(V-) DA5.6(SHDN) R11.2 R13.2 R16.1 ; port AGND
ADC: C32.1 R14.2 ; port ADC
Anode: R10.2 R11.1 ; port Anode
Cathode: C27.2 DA4.2(IN-) R9.1 ; port Cathode
Error: DA5.5(OUT) ; port Error
NetC27_1: C27.1 DA4.1(FB) R9.2 R9.3
NetC33_1: C33.1 DA5.1(-IN) R15.2
NetDA4_6: DA4.6(OUT) R12.1
NetDA5_3: DA5.3(+IN) R16.2
NetR12_2: R12.2 R13.1 R14.1 R15.1

Not connected (* = marked no-connect by the designer): DA4 5(NIC)

### Channels
A1: designators end in A1; ports +3.3VA=+3.3VA +5VA=+5VA -5VA=-5VA ADC=PD3_ADC AGND=AGND Anode=PD3_A Cathode=PD3_C Error=PD3_ERR
A2: designators end in A2; ports +3.3VA=+3.3VA +5VA=+5VA -5VA=-5VA ADC=PD2_ADC AGND=AGND Anode=PD2_A Cathode=PD2_C Error=PD2_ERR
A3: designators end in A3; ports +3.3VA=+3.3VA +5VA=+5VA -5VA=-5VA ADC=PD1_ADC AGND=AGND Anode=PD1_A Cathode=PD1_C Error=PD1_ERR

### Notes on the sheet
- Подп. и дата
- Инв. № дубл.
- Взам. инв. №
- Инв. № подл.
- Изм.
- Лист
- № докум.
- Подп.
- Дата
- Копировал
- Формат А3
- (in symbol TLV3501) COMP

### Library data of the parts
C27 C33 = Capacitor: Manufacturer: Murata; Model: GRM1885C1H220JA01D; Value: 22пФ; Document: *
C28 C31 = Capacitor_Polar: Model: TECAP, 10 мкФ, 10 В, тип A, 10%; Value: 10мкФх10B; Document: *; Manufacturer: *
C29 C30 C32 C34 = Capacitor: as C3 on sheet Main; Value: 0,1мкФ; Document: *
C35 = Capacitor: as C16 on sheet Main; Value: 2,2мкФ; Document: *
DA4 = ADA4817-1ARDZ: Manufacturer: Analog Devices; Model: ADA4817-1ARDZ; Document: *
DA5 = TLV3501: Manufacturer: Texas Instruments; Model: TLV3501AIDBVR; Document: *
R9 = Resistor_Variable: Manufacturer: Bourns; Model: 3224W-1-105; Value: 1М; Document: *
R10 = Resistor: as R103 on sheet Hardwiring; Value: 0; Document: *
R11 = Resistor: Value: NA; Model: *; Document: *; Manufacturer: *
R12 = Resistor: Manufacturer: Yageo; Model: RC0603FR-075K1L; Value: 5,1к; Document: *
R13-R15 = Resistor: as R4 on sheet Main; Value: 10к; Document: *
R16 = Resistor_Variable: Manufacturer: Bourns; Model: 3224W-1-103; Value: 10к; Document: *

## Sheet Power_supply.SchDoc
size 420 x 297 mm; Address1: Address1; Address2: Address2; Address3: Address3; Address4: Address4; DocumentNumber: *Э3; SheetNumber: 4; SheetTotal: 11; DocumentType: Схема электрическая *
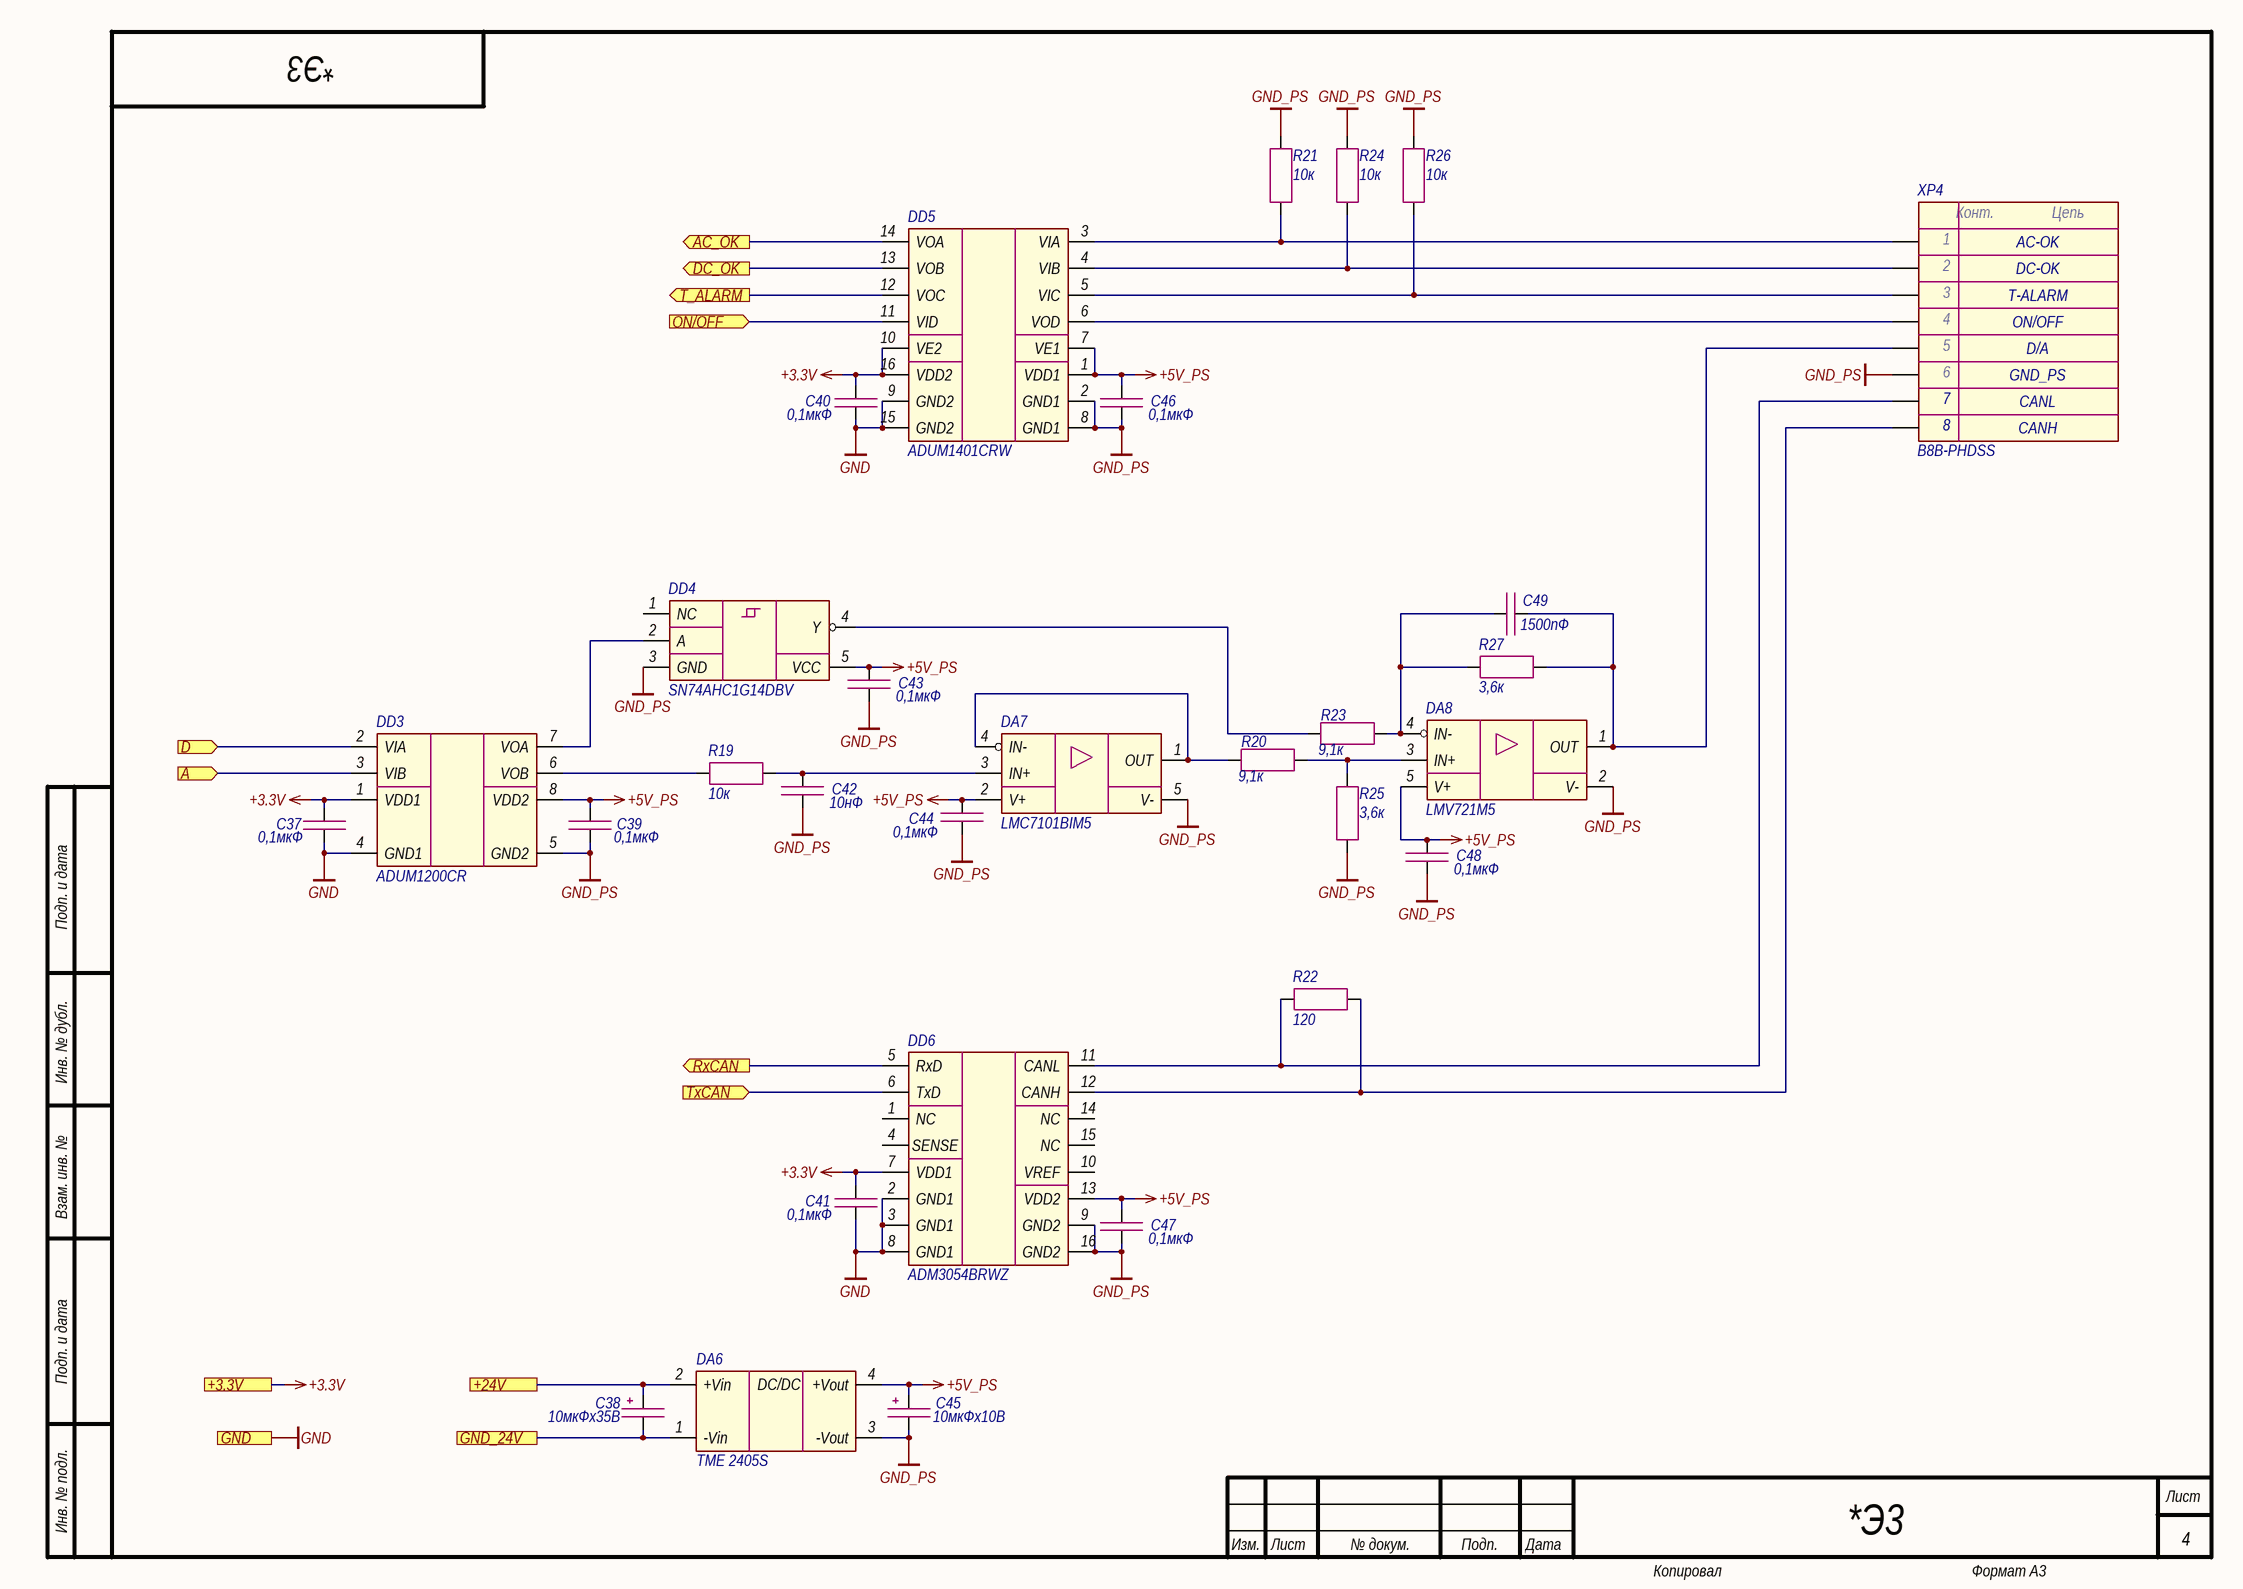
[diagram p4: Power_supply.SchDoc]

### Parts
C37  0,1мкФ  [CAP_0603]
C38  10мкФх35B  [CAP_C]
C39  0,1мкФ  [CAP_0603]
C40  0,1мкФ  [CAP_0603]
C41  0,1мкФ  [CAP_0603]
C42  10нФ  [CAP_0603]
C43  0,1мкФ  [CAP_0603]
C44  0,1мкФ  [CAP_0603]
C45  10мкФх10B  [CAP_A]
C46  0,1мкФ  [CAP_0603]
C47  0,1мкФ  [CAP_0603]
C48  0,1мкФ  [CAP_0603]
C49  1500пФ  [CAP_0603]
DA6  TME 2405S  [TME (SIP-4)]
DA7  LMC7101BIM5  [SOT-23-5]
DA8  LMV721M5  [SOT-23-5]
DD3  ADUM1200CR  [SOIC-8]
DD4  SN74AHC1G14DBV  [SOT-23-5]
DD5  ADUM1401CRW  [SOIC-16W]
DD6  ADM3054BRWZ  [SOIC-16W]
R19  10к  [RES_0603]
R20  9,1к  [RES_0603]
R21  10к  [RES_0603]
R22  120  [RES_0603]
R23  9,1к  [RES_0603]
R24  10к  [RES_0603]
R25  3,6к  [RES_0603]
R26  10к  [RES_0603]
R27  3,6к  [RES_0603]
XP4  B8B-PHDSS  [B8B-PHDSS]

### Ports
+3.3V (see Main[1B], Ethernet[3D], Fiber_interlock[2C], Flow_sensor[2C], Hardwiring[3D], LD_driver[1D]), +24V (see Main[1B], Flow_sensor[2C], Hardwiring[3C], Indication[1C], LD_driver[1D]), A (in, see Main[1B]), AC_OK (out, see Main[2B]), D (in, see Main[1B]), DC_OK (out, see Main[2B]), GND (see Main[1B], Ethernet[3D], Fiber_interlock[2C], Flow_sensor[2C], Guide_laser[1C], Hardwiring[3D], Indication[1C], LD_driver[1D]), GND_24V (see Main[1C], Flow_sensor[2C], Hardwiring[3C], Indication[1C], LD_driver[1D]), ON/OFF (in, see Main[1B]), RxCAN (out, see Main[2B]), T_ALARM (out, see Main[2B]), TxCAN (in, see Main[2B])

### Nets
+3.3V: C37.1 C40.1 C41.1 DD3.1(VDD1) DD5.10(VE2) DD5.16(VDD2) DD6.7(VDD1) ; port +3.3V
+5V_PS: C39.1 C43.1 C44.1 C45.1 C46.1 C47.1 C48.1 DA6.4(+Vout) DA7.2(V+) DA8.5(V+) DD3.8(VDD2) DD4.5(VCC) DD5.1(VDD1) DD5.7(VE1) DD6.13(VDD2)
+24V: C38.1 DA6.2(+Vin) ; port +24V
GND: C37.2 C40.2 C41.2 DD3.4(GND1) DD5.9(GND2) DD5.15(GND2) DD6.2(GND1) DD6.3(GND1) DD6.8(GND1) ; port GND
GND_24V: C38.2 DA6.1(-Vin) ; port GND_24V
GND_PS: C39.2 C42.2 C43.2 C44.2 C45.2 C46.2 C47.2 C48.2 DA6.3(-Vout) DA7.5(V-) DA8.2(V-) DD3.5(GND2) DD4.3(GND) DD5.2(GND1) DD5.8(GND1) DD6.9(GND2) DD6.16(GND2) R21.1 R24.1 R25.2 R26.1 XP4.6
PS_A: DD3.3(VIB) ; port A
PS_D: DD3.2(VIA) ; port D
PS_ERR1: DD5.14(VOA) ; port AC_OK
PS_ERR2: DD5.13(VOB) ; port DC_OK
PS_ERR3: DD5.12(VOC) ; port T_ALARM
PS_ON: DD5.11(VID) ; port ON/OFF
RxCAN: DD6.5(RxD) ; port RxCAN
TxCAN: DD6.6(TxD) ; port TxCAN
NetC42_1: C42.1 DA7.3(IN+) R19.2
NetC49_1: C49.1 DA8.4(IN-) R23.1 R27.2
NetC49_2: C49.2 DA8.1(OUT) R27.1 XP4.5
NetDA7_1: DA7.1(OUT) DA7.4(IN-) R20.2
NetDA8_3: DA8.3(IN+) R20.1 R25.1
NetDD3_6: DD3.6(VOB) R19.1
NetDD3_7: DD3.7(VOA) DD4.2(A)
NetDD4_4: DD4.4(Y) R23.2
NetDD5_3: DD5.3(VIA) R21.2 XP4.1
NetDD5_4: DD5.4(VIB) R24.2 XP4.2
NetDD5_5: DD5.5(VIC) R26.2 XP4.3
NetDD5_6: DD5.6(VOD) XP4.4
NetDD6_11: DD6.11(CANL) R22.1 XP4.7
NetDD6_12: DD6.12(CANH) R22.2 XP4.8

Not connected (* = marked no-connect by the designer): DD4 1(NC); DD6 1(NC) 4(SENSE) 10(VREF) 14(NC) 15(NC)

### Notes on the sheet
- AC-OK
- DC-OK
- T-ALARM
- ON/OFF
- CANL
- GND_PS
- D/A
- CANH
- Подп. и дата
- Инв. № дубл.
- Взам. инв. №
- Инв. № подл.
- Изм.
- Лист
- № докум.
- Подп.
- Дата
- Копировал
- Формат А3
- (in symbol Connector-8) Конт.; Цепь
- (in symbol TME) DC/DC

### Library data of the parts
C37 C39-C41 C43 C44 C46-C48 = Capacitor: as C3 on sheet Main; Value: 0,1мкФ; Document: *
C38 = Capacitor_Polar: Model: TECAP, 10 мкФ, 35 В, тип C, 10%; Value: 10мкФх35B; Document: *; Manufacturer: *
C42 = Capacitor: Manufacturer: Murata; Model: GRM188R71H103JA01D; Value: 10нФ; Document: *
C45 = Capacitor_Polar: Model: TECAP, 10 мкФ, 10 В, тип A, 10%; Value: 10мкФх10B; Document: *; Manufacturer: *
C49 = Capacitor: Manufacturer: Murata; Model: GRM188R71H152KA01D; Value: 1500пФ; Document: *
DA6 = TME: Manufacturer: Traco Power; Model: TME 2405S; Document: *
DA7 = LMC7101: Manufacturer: Texas Instruments; Model: LMC7101BIM5; Document: *
DA8 = LMV721M5: Manufacturer: Texas Instruments; Model: LMV721M5; Document: *
DD3 = ADUM1200: Manufacturer: Analog Devices; Model: ADUM1200CR; Document: *
DD4 = SN74AHC1G14: Manufacturer: Texas Instruments; Model: SN74AHC1G14DBV; Document: *
DD5 = ADUM1401: Manufacturer: Analog Devices; Model: ADUM1401CRW; Document: *
DD6 = ADM3054BRWZ: Manufacturer: Analog Devices; Model: ADM3054BRWZ; Document: *
R19 R21 R24 R26 = Resistor: as R4 on sheet Main; Value: 10к; Document: *
R20 R23 = Resistor: Manufacturer: Yageo; Model: RC0603FR-079K1L; Value: 9,1к; Document: *
R22 = Resistor: Manufacturer: Yageo; Model: RC0603FR-07120RL; Value: 120; Document: *
R25 R27 = Resistor: Manufacturer: Yageo; Model: RC0603FR-073K6L; Value: 3,6к; Document: *
XP4 = Connector-8: Manufacturer: JST; Model: B8B-PHDSS; Document: *

## Sheet Guide_laser.SchDoc
size 420 x 297 mm; Address1: Address1; Address2: Address2; Address3: Address3; Address4: Address4; DocumentNumber: *Э3; SheetNumber: 6; SheetTotal: 11; DocumentType: Схема электрическая *
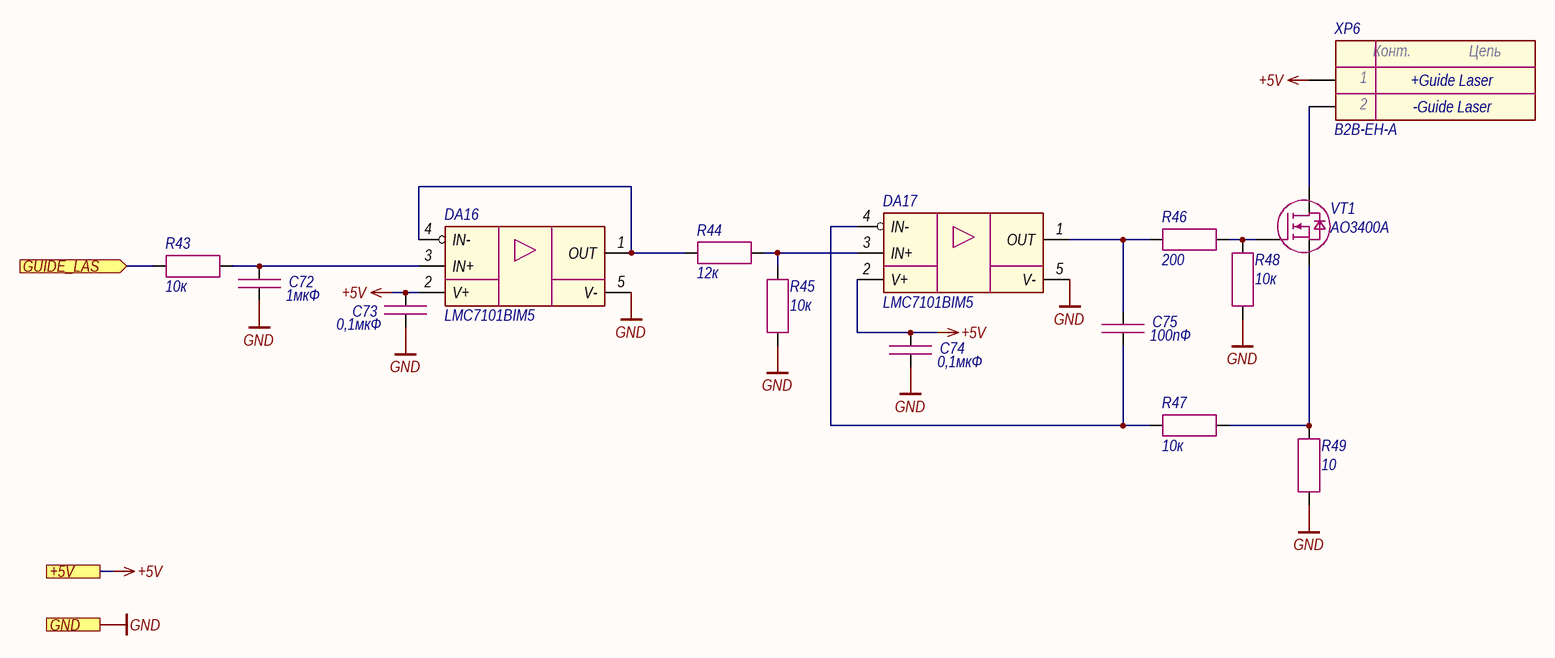
[diagram p5: Guide_laser.SchDoc]

### Parts
C72  1мкФ  [CAP_0603]
C73  0,1мкФ  [CAP_0603]
C74  0,1мкФ  [CAP_0603]
C75  100пФ  [CAP_0603]
DA16  LMC7101BIM5  [SOT-23-5]
DA17  LMC7101BIM5  [SOT-23-5]
R43  10к  [RES_0603]
R44  12к  [RES_0603]
R45  10к  [RES_0603]
R46  200  [RES_0603]
R47  10к  [RES_0603]
R48  10к  [RES_0603]
R49  10  [RES_1210]
VT1  AO3400A  [SOT-23-3]
XP6  B2B-EH-A  [B2B-EH-A]

### Ports
+5V (see Main[2A]), GND (see Main[2A], Ethernet[3D], Fiber_interlock[2C], Flow_sensor[2C], Hardwiring[3D], Indication[1C], LD_driver[1D], Power_supply[1D]), GUIDE_LAS (in, see Main[3A])

### Nets
+5V: C73.1 C74.1 DA16.2(V+) DA17.2(V+) XP6.1 ; port +5V
GND: C72.2 C73.2 C74.2 DA16.5(V-) DA17.5(V-) R45.2 R48.1 R49.1 ; port GND
GUIDE_LAS: R43.1 ; port GUIDE_LAS
NetC72_1: C72.1 DA16.3(IN+) R43.2
NetC75_1: C75.1 DA17.1(OUT) R46.1
NetC75_2: C75.2 DA17.4(IN-) R47.1
NetDA16_1: DA16.1(OUT) DA16.4(IN-) R44.1
NetDA17_3: DA17.3(IN+) R44.2 R45.1
NetR46_2: R46.2 R48.2 VT1.1(G)
NetR47_2: R47.2 R49.2 VT1.2(S)
NetVT1_3: VT1.3(D) XP6.2

### Notes on the sheet
- +Guide Laser
- -Guide Laser
- Подп. и дата
- Инв. № дубл.
- Взам. инв. №
- Инв. № подл.
- Изм.
- Лист
- № докум.
- Подп.
- Дата
- Копировал
- Формат А3
- (in symbol Connector-2) Конт.; Цепь

### Library data of the parts
C72 = Capacitor: as C7 on sheet Main; Value: 1мкФ; Document: *
C73 C74 = Capacitor: as C3 on sheet Main; Value: 0,1мкФ; Document: *
C75 = Capacitor: as C96 on sheet Hardwiring; Value: 100пФ; Document: *
DA16 DA17 = LMC7101: Manufacturer: Texas Instruments; Model: LMC7101BIM5; Document: *
R43 R45 R47 R48 = Resistor: as R4 on sheet Main; Value: 10к; Document: *
R44 = Resistor: Manufacturer: Yageo; Model: RC0603FR-0712KL; Value: 12к; Document: *
R46 = Resistor: as R6 on sheet Main; Value: 200; Document: *
R49 = Resistor: Manufacturer: Yageo; Model: RC1210FR-0710RL; Value: 10; Document: *
VT1 = MOSFET N-channel: Manufacturer: UMW; Model: AO3400A; Document: *
XP6 = Connector-2: Manufacturer: JST; Model: B2B-EH-A; Document: *

## Nets that join several sheets
+3.3V: Main (23 pins), Hardwiring (13 pins), Power_supply (7 pins)
+3.3VA: Main (6 pins), A1 (C34A1.1 C35A1.1 DA5A1.4 R16A1.3), A2 (C34A2.1 C35A2.1 DA5A2.4 R16A2.3), A3 (C34A3.1 C35A3.1 DA5A3.4 R16A3.3)
+5V: Main (8 pins), Guide_laser (5 pins)
+5VA: Main (C3.1 L1.2), Hardwiring (C99.1 C102.1 DA19.2 U6.8), A1 (C30A1.1 C31A1.1 DA4A1.7 DA4A1.8), A2 (C30A2.1 C31A2.1 DA4A2.7 DA4A2.8), A3 (C30A3.1 C31A3.1 DA4A3.7 DA4A3.8)
+24V: Main (C1.1 DA1.2 XP2.1), Indication (XP7.1 XP7.3 XP7.5), Hardwiring (C106.1 DA20.2), Power_supply (C38.1 DA6.2)
-5VA: Main (C11.1 L3.2), A1 (C28A1.2 C29A1.1 DA4A1.4 R10A1.1), A2 (C28A2.2 C29A2.1 DA4A2.4 R10A2.1), A3 (C28A3.2 C29A3.1 DA4A3.4 R10A3.1)
AGND: Main (11 pins), Hardwiring (6 pins), A1 (15 pins), A2 (15 pins), A3 (15 pins)
GND: Main (39 pins), Indication (U3.2 U4.2 U5.2), Hardwiring (16 pins), Power_supply (9 pins), Guide_laser (8 pins)
GND_24V: Main (C1.2 DA1.1 XP2.2), Indication (U3.3 U4.3 U5.3), Hardwiring (C106.2 DA20.1), Power_supply (C38.2 DA6.1)
CRASH_IND: Main (DD1.3), Indication (R52.2)
EMIS_IND: Main (DD1.2), Indication (R51.2)
EXT_AN_MOD: Main (DD1.32), Hardwiring (C104.2 DA19.1 R97.1)
EXT_COM1: Main (DD1.39), Hardwiring (DD11.13)
EXT_COM2: Main (DD1.41), Hardwiring (DD11.12)
EXT_COM3: Main (DD1.42), Hardwiring (DD11.11)
EXT_DIG_MOD: Main (DD1.40), Hardwiring (DD11.14)
EXT_FLAG1: Main (DD1.43), Hardwiring (R98.2)
EXT_FLAG2: Main (DD1.44), Hardwiring (R99.2)
EXT_FLAG3: Main (DD1.45), Hardwiring (R100.2)
EXT_FLAG4: Main (DD1.46), Hardwiring (R101.2)
EXT_IL1: Main (DD1.33), Hardwiring (R90.2 U7.16)
EXT_IL2: Main (DD1.34), Hardwiring (R91.2 U7.14)
EXT_KEY: Main (DD1.36), Hardwiring (R93.2 U7.12)
EXT_MP_EN: Main (DD1.38), Hardwiring (R94.2 U7.10)
EXT_PMO: Main (DD1.35), Hardwiring (DD12.2)
GUIDE_LAS: Main (DD1.4), Guide_laser (R43.1)
PD1_A: Main (XP1.2), A3 (R10A3.2 R11A3.1)
PD1_ADC: Main (DD1.25), A3 (C32A3.1 R14A3.2)
PD1_C: Main (XP1.1), A3 (C27A3.2 DA4A3.2 R9A3.1)
PD1_ERR: Main (DD1.16), A3 (DA5A3.5)
PD2_A: Main (XP1.4), A2 (R10A2.2 R11A2.1)
PD2_ADC: Main (DD1.24), A2 (C32A2.1 R14A2.2)
PD2_C: Main (XP1.3), A2 (C27A2.2 DA4A2.2 R9A2.1)
PD2_ERR: Main (DD1.17), A2 (DA5A2.5)
PD3_A: Main (XP1.6), A1 (R10A1.2 R11A1.1)
PD3_ADC: Main (DD1.23), A1 (C32A1.1 R14A1.2)
PD3_C: Main (XP1.5), A1 (C27A1.2 DA4A1.2 R9A1.1)
PD3_ERR: Main (DD1.18), A1 (DA5A1.5)
POWER_IND: Main (DD1.1), Indication (R50.2)
PS_A: Main (DD1.96), Power_supply (DD3.3)
PS_D: Main (DD1.95), Power_supply (DD3.2)
PS_ERR1: Main (DD1.66), Power_supply (DD5.14)
PS_ERR2: Main (DD1.67), Power_supply (DD5.13)
PS_ERR3: Main (DD1.68), Power_supply (DD5.12)
PS_ON: Main (DD1.69), Power_supply (DD5.11)
RE/DE: Main (DD1.51), Hardwiring (DD10.4 DD10.5)
Rx485: Main (DD1.48), Hardwiring (DD10.3)
RxCAN: Main (DD1.70), Power_supply (DD6.5)
Tx485: Main (DD1.47), Hardwiring (DD10.6)
TxCAN: Main (DD1.71), Power_supply (DD6.6)